# EasyEDA schematic SCH_AP1_Sistema-Digitais_2026-10-01.json

## Sheets
1 Sheet_1: TITLE: Sheet_1; REV: 1.0; Date: 2026-09-23; Sheet: 1/1; Drawn By: jvbathomarco; Company: Your Company
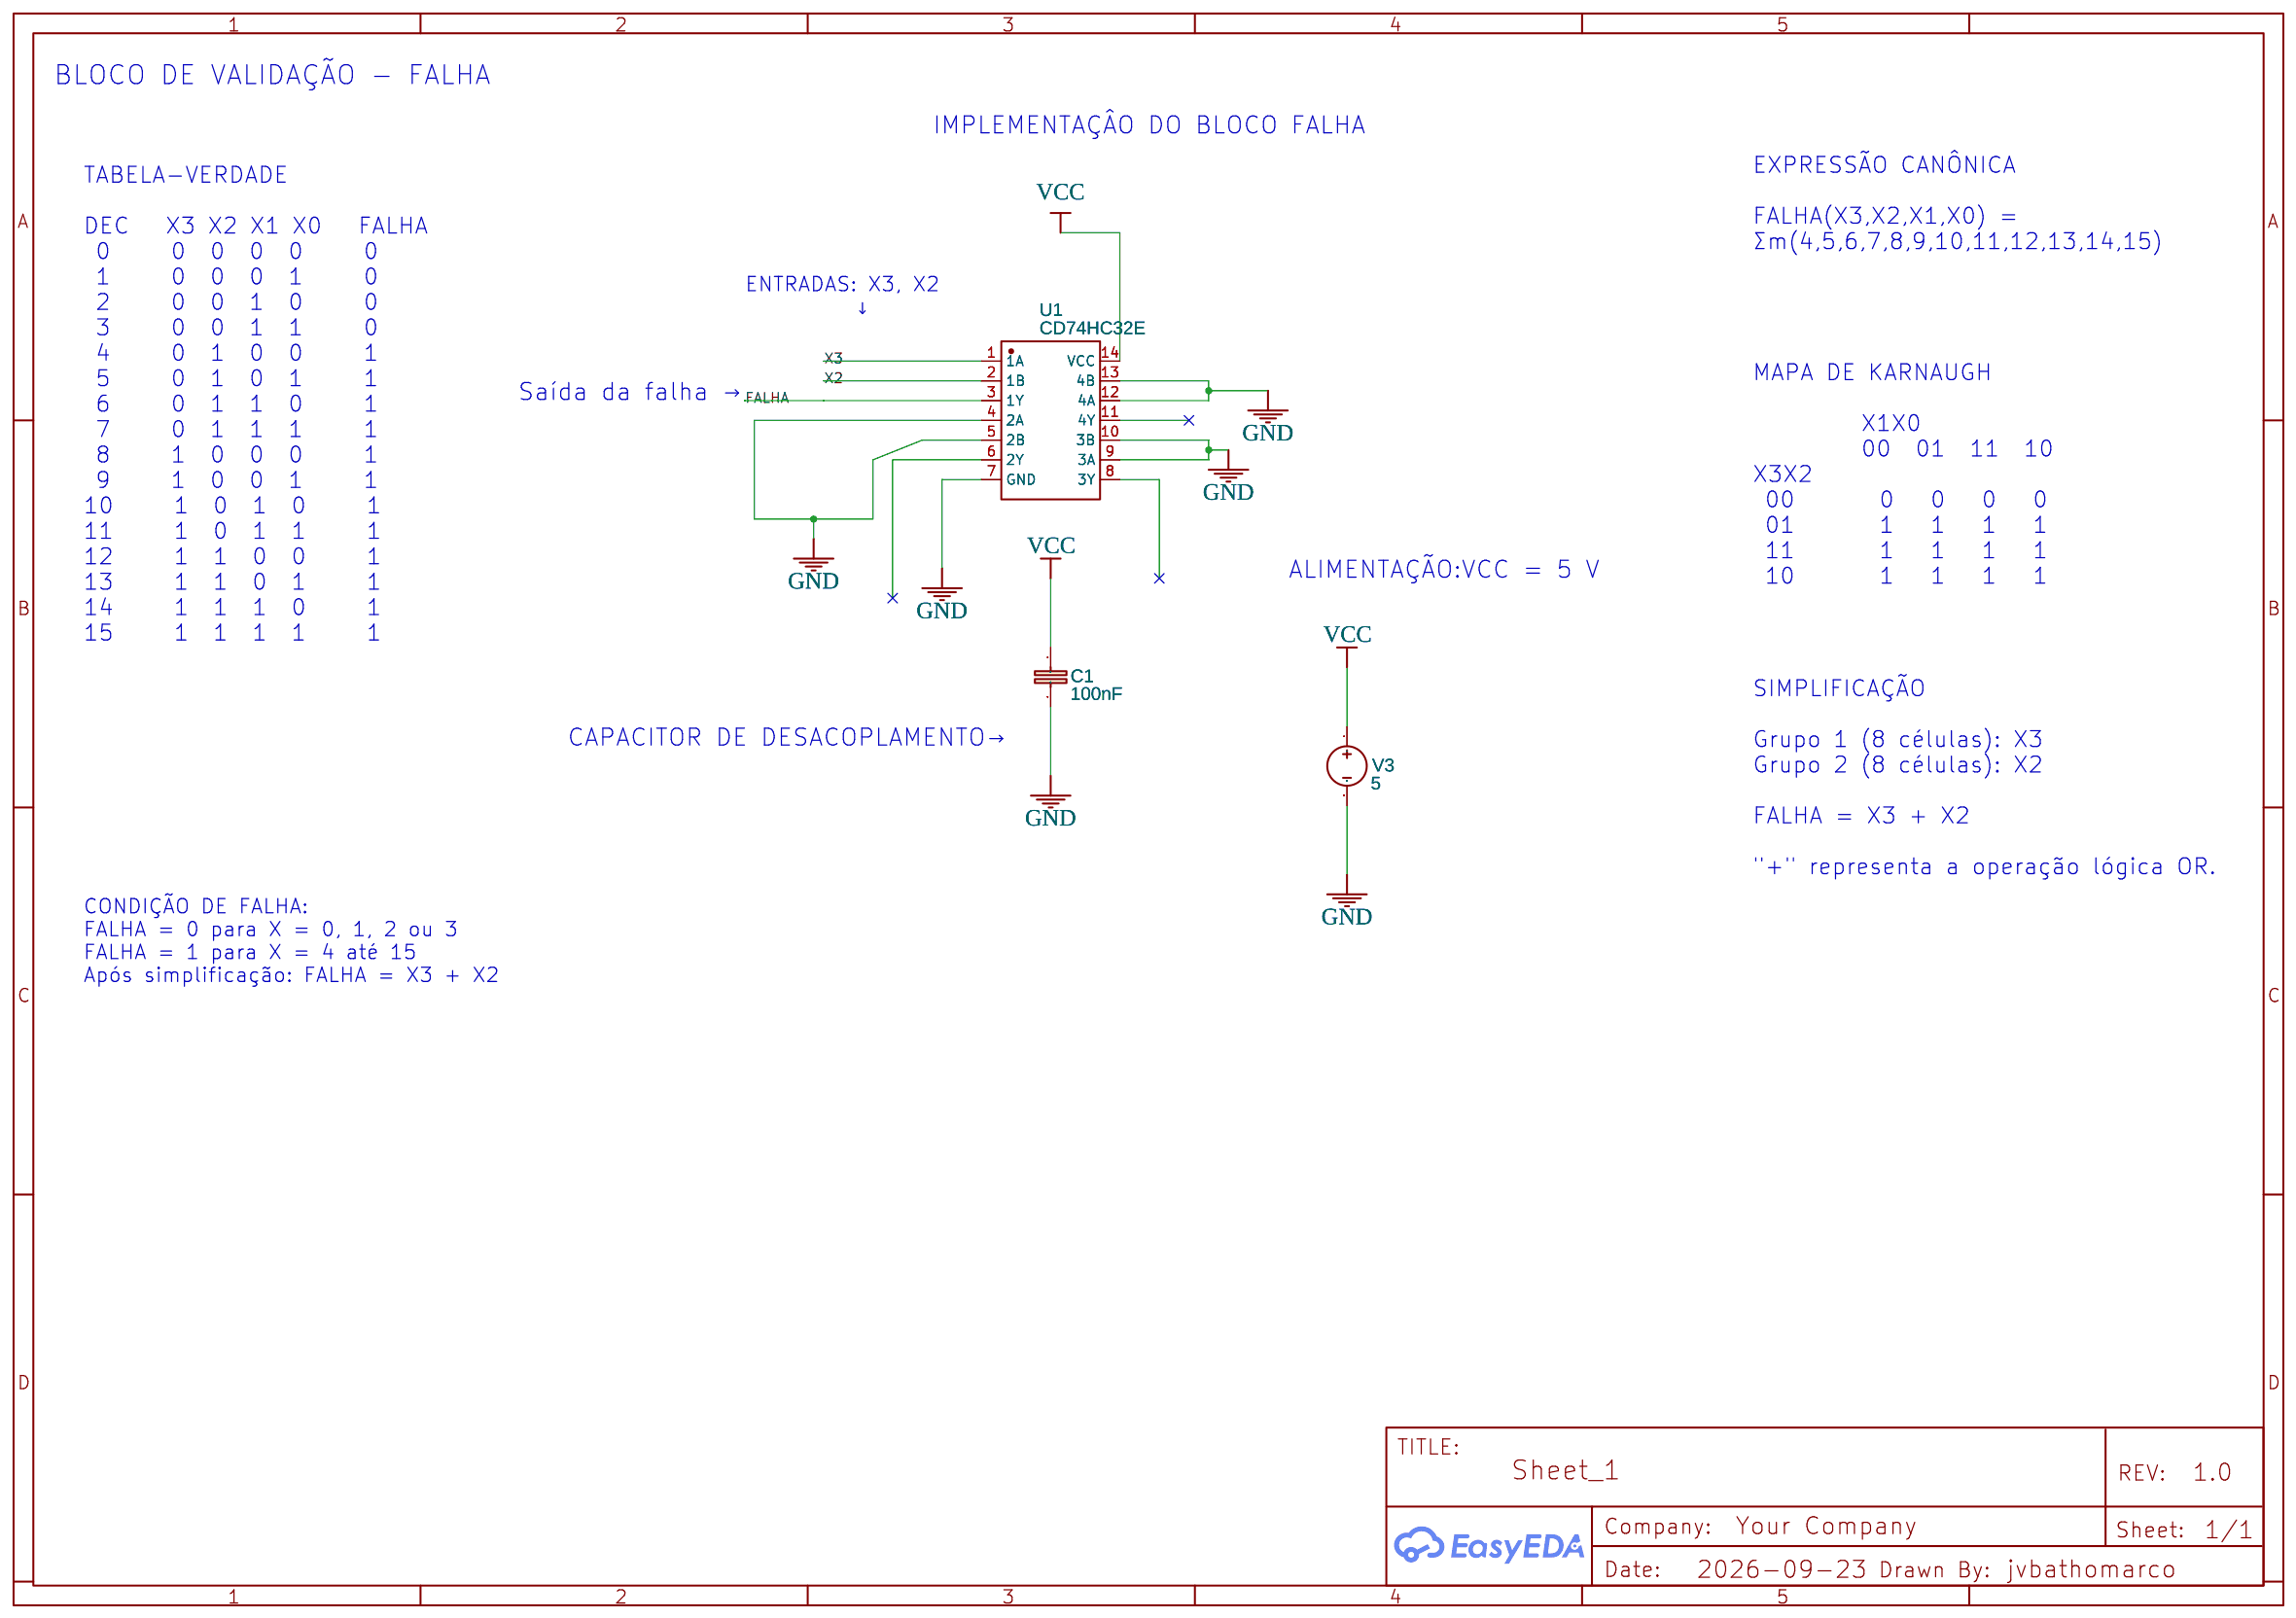
[diagram p0: Sheet_1]
2 Sheet_2: TITLE: Sheet_2
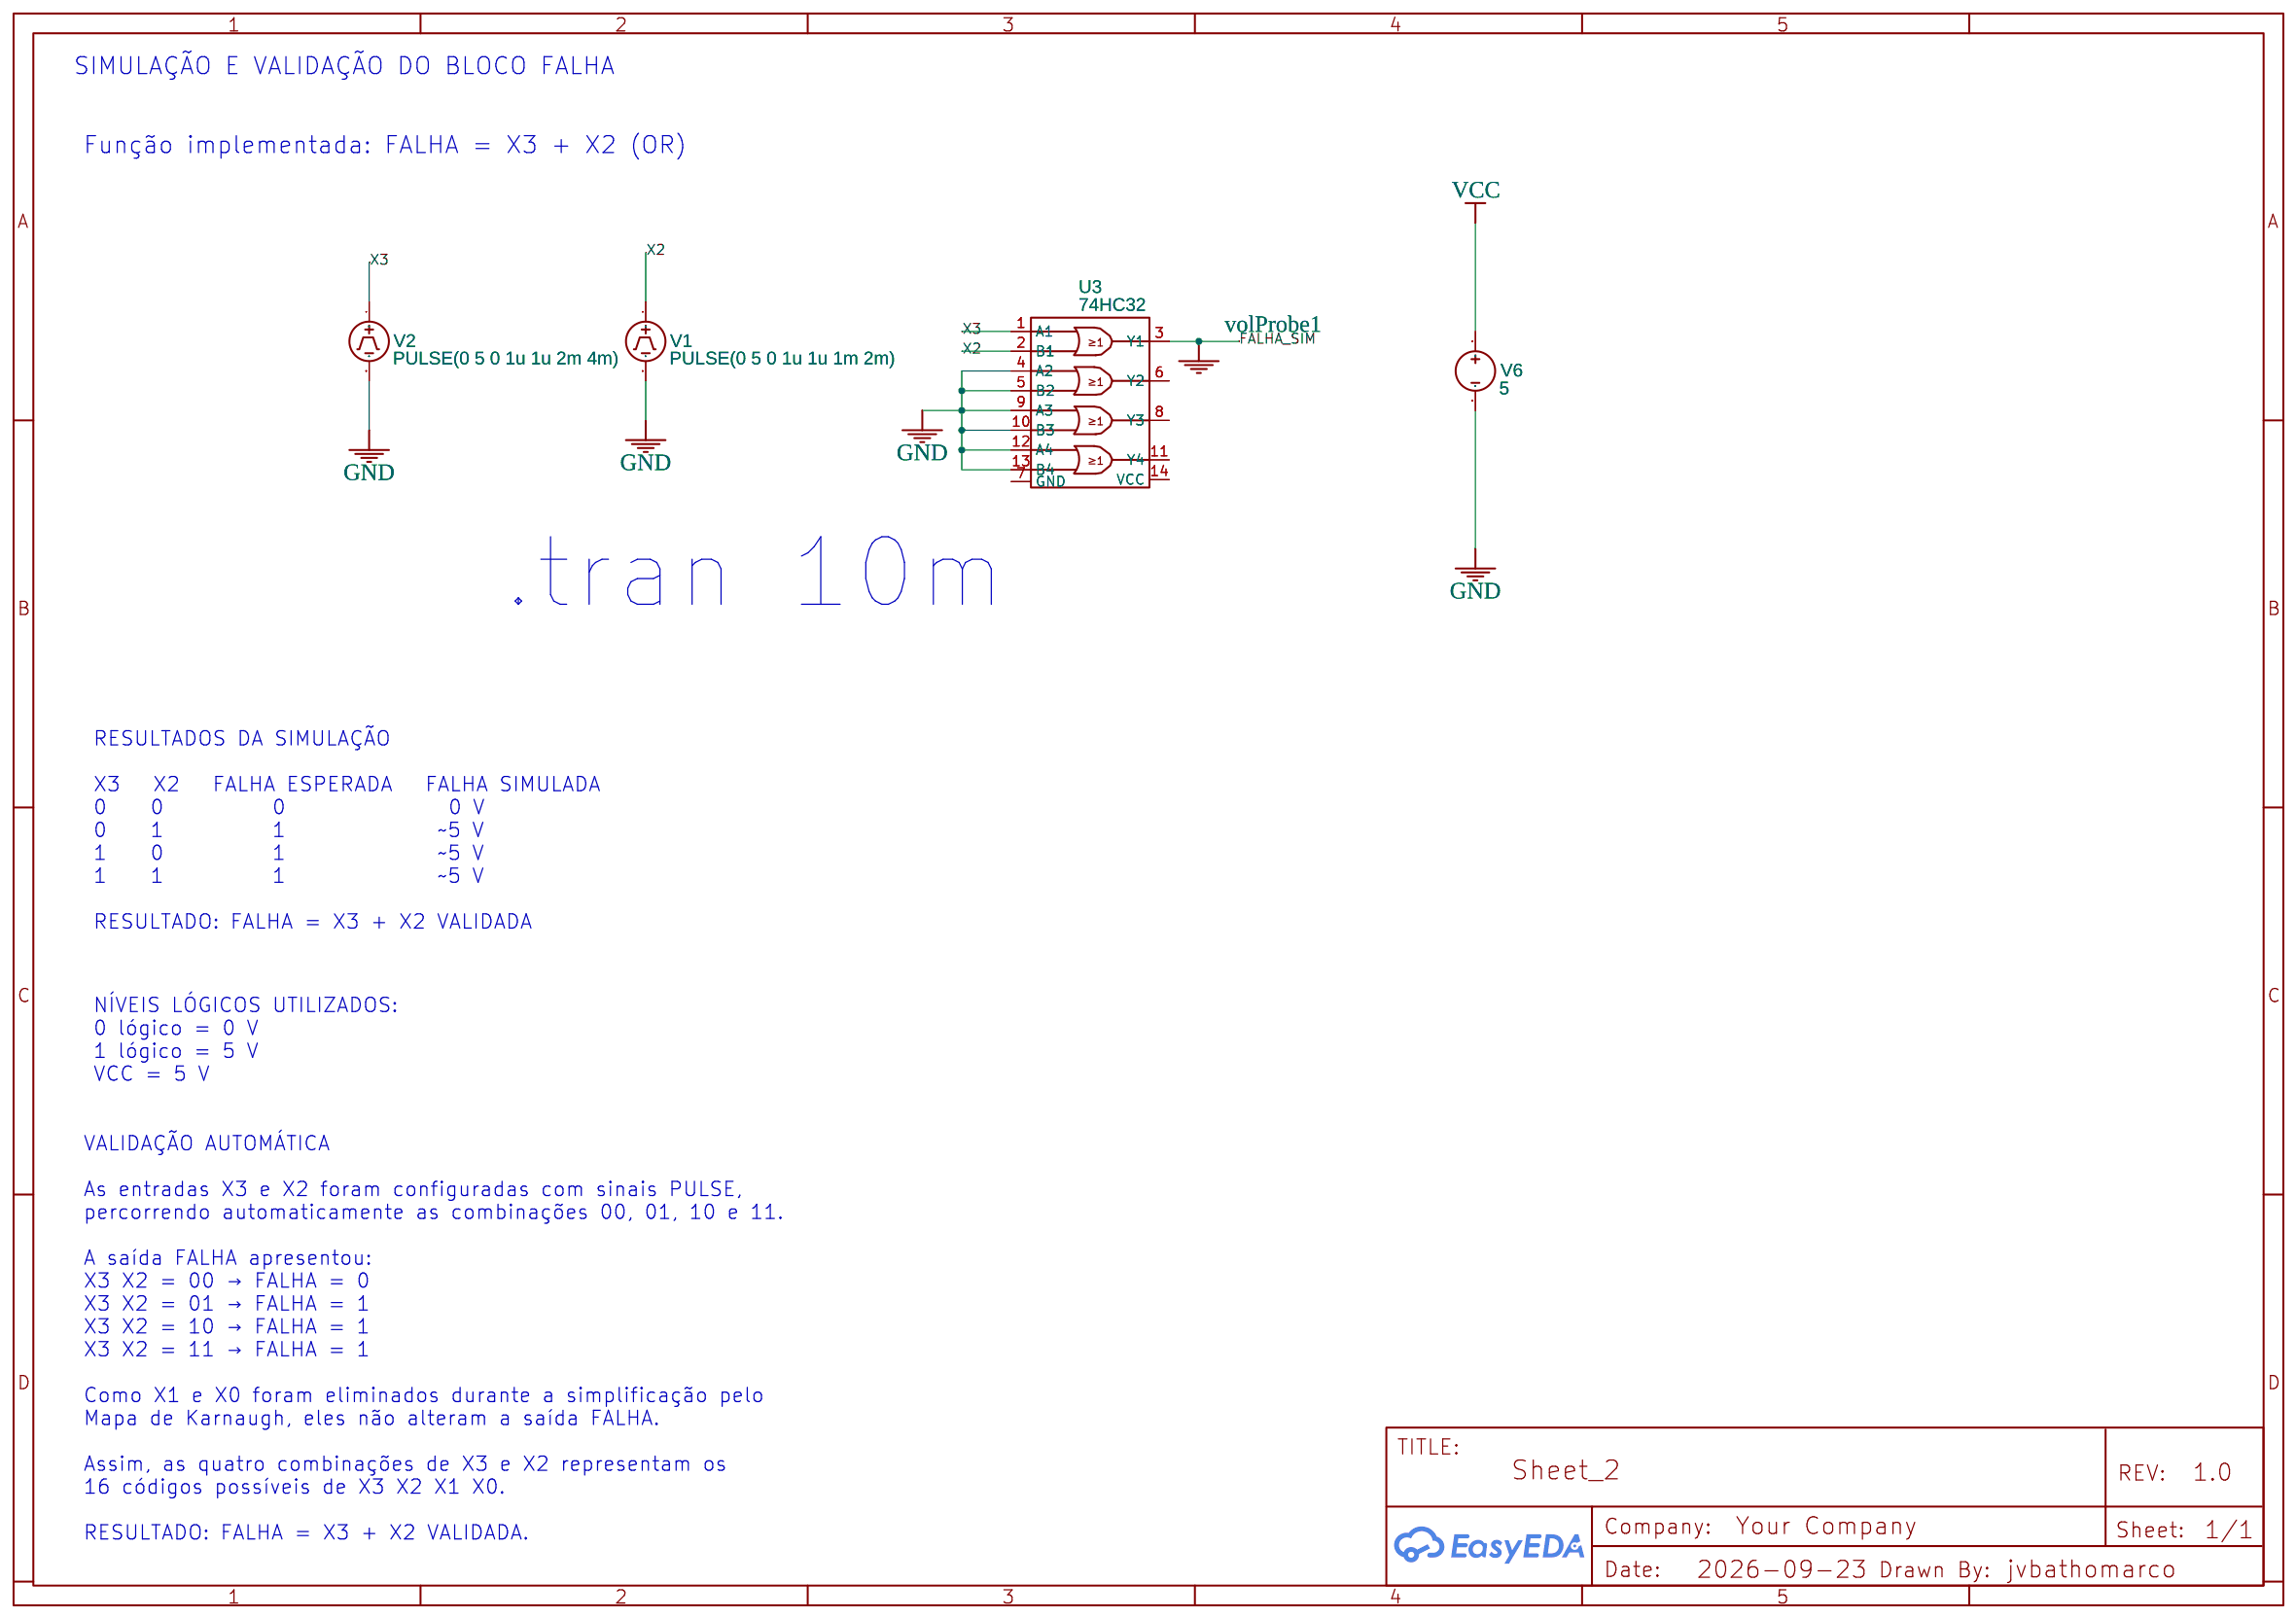
[diagram p1: Sheet_2]

## Parts
sheet Sheet_1
C1  100nF  [C0.1PTH]
U1  CD74HC32E  [PDIP-14_L19.3-W6.4-P2.54-LS7.9-BL-1]
V3  5  [HDR1X2]
sheet Sheet_2
U3  74HC32  [SOIC-14_L8.7-W3.9-P1.27-LS6.0-BL]
V1  PULSE(0 5 0 1u 1u 1m 2m)  [HDR1X2]
V2  PULSE(0 5 0 1u 1u 2m 4m)  [HDR1X2]
V6  5  [HDR1X2]

## Library data of the parts
C1 = CAPACITOR_NPOL-PTH_0.1: Non-Polarized capacitor in various packages; Contributor: DangerousPrototype
U1 = CD74HC32E: Contributor: LCSC; Supplier: LCSC; Supplier Part: C2864859; Manufacturer: TI(德州仪器); JLCPCB Part Class: Extended Part
V3 V6 = VDC: Contributor: EasyEDA; sim: true
U3 = DIGITAL: catid: 20; Contributor: 立创EDA官方封装库; sim: true
V1 V2 = VPULSE: Contributor: EasyEDA; sim: true

## Nets
GND: C1.2 U1.4(2A) U1.5(2B) U1.7(GND) U1.9(3A) U1.10(3B) U1.12(4A) U1.13(4B) U3.4(A2) U3.5(B2) U3.9(A3) U3.10(B3) U3.12(A4) U3.13(B4) V1.2 V2.2 V3.2 V6.2
VCC: C1.1 U1.14(VCC) V3.1 V6.1
FALHA: U1.3(1Y)
FALHA_SIM: U3.3(Y1)
X2: U1.2(1B) U3.2(B1) V1.1
X3: U1.1(1A) U3.1(A1) V2.1

Not connected (* = marked no-connect by the designer): U1 6(2Y) 8(3Y) 11(4Y); U3 6(Y2) 7(GND) 8(Y3) 11(Y4) 14(VCC)

## Notes on the sheets
sheet 1
- BLOCO DE VALIDAÇÃO - FALHA
- IMPLEMENTAÇÂO DO BLOCO FALHA
- EXPRESSÃO CANÔNICA
  FALHA(X3,X2,X1,X0) =
  Σm(4,5,6,7,8,9,10,11,12,13,14,15)
- TABELA-VERDADE
  DEC   X3 X2 X1 X0   FALHA
   0     0  0  0  0     0
   1     0  0  0  1     0
   2     0  0  1  0     0
   3     0  0  1  1     0
   4     0  1  0  0     1
   5     0  1  0  1     1
   6     0  1  1  0     1
   7     0  1  1  1     1
   8     1  0  0  0     1
   9     1  0  0  1     1
  10     1  0  1  0     1
  11     1  0  1  1     1
  12     1  1  0  0     1
  13     1  1  0  1     1
  14     1  1  1  0     1
  15     1  1  1  1     1
- ENTRADAS: X3, X2
            ↓
- MAPA DE KARNAUGH
           X1X0
           00  01  11  10
  X3X2
   00       0   0   0   0
   01       1   1   1   1
   11       1   1   1   1
   10       1   1   1   1
- Saída da falha →
- ALIMENTAÇÃO:VCC = 5 V
- SIMPLIFICAÇÃO
  Grupo 1 (8 células): X3
  Grupo 2 (8 células): X2
  FALHA = X3 + X2
  "+" representa a operação lógica OR.
- CAPACITOR DE DESACOPLAMENTO→
- CONDIÇÃO DE FALHA:
  FALHA = 0 para X = 0, 1, 2 ou 3
  FALHA = 1 para X = 4 até 15
  Após simplificação: FALHA = X3 + X2
sheet 2
- SIMULAÇÃO E VALIDAÇÃO DO BLOCO FALHA
- Função implementada: FALHA = X3 + X2 (OR)
- .tran 10m
- RESULTADOS DA SIMULAÇÃO
  X3   X2   FALHA ESPERADA   FALHA SIMULADA
  0    0          0               0 V
  0    1          1              ~5 V
  1    0          1              ~5 V
  1    1          1              ~5 V
  RESULTADO: FALHA = X3 + X2 VALIDADA
- NÍVEIS LÓGICOS UTILIZADOS:
  0 lógico = 0 V
  1 lógico = 5 V
  VCC = 5 V
- VALIDAÇÃO AUTOMÁTICA
  As entradas X3 e X2 foram configuradas com sinais PULSE,
  percorrendo automaticamente as combinações 00, 01, 10 e 11.
  A saída FALHA apresentou:
  X3 X2 = 00 → FALHA = 0
  X3 X2 = 01 → FALHA = 1
  X3 X2 = 10 → FALHA = 1
  X3 X2 = 11 → FALHA = 1
  Como X1 e X0 foram eliminados durante a simplificação pelo
  Mapa de Karnaugh, eles não alteram a saída FALHA.
  Assim, as quatro combinações de X3 e X2 representam os
  16 códigos possíveis de X3 X2 X1 X0.
  RESULTADO: FALHA = X3 + X2 VALIDADA.
